# EAGLE design do31 (EAGLE 9.6.2)
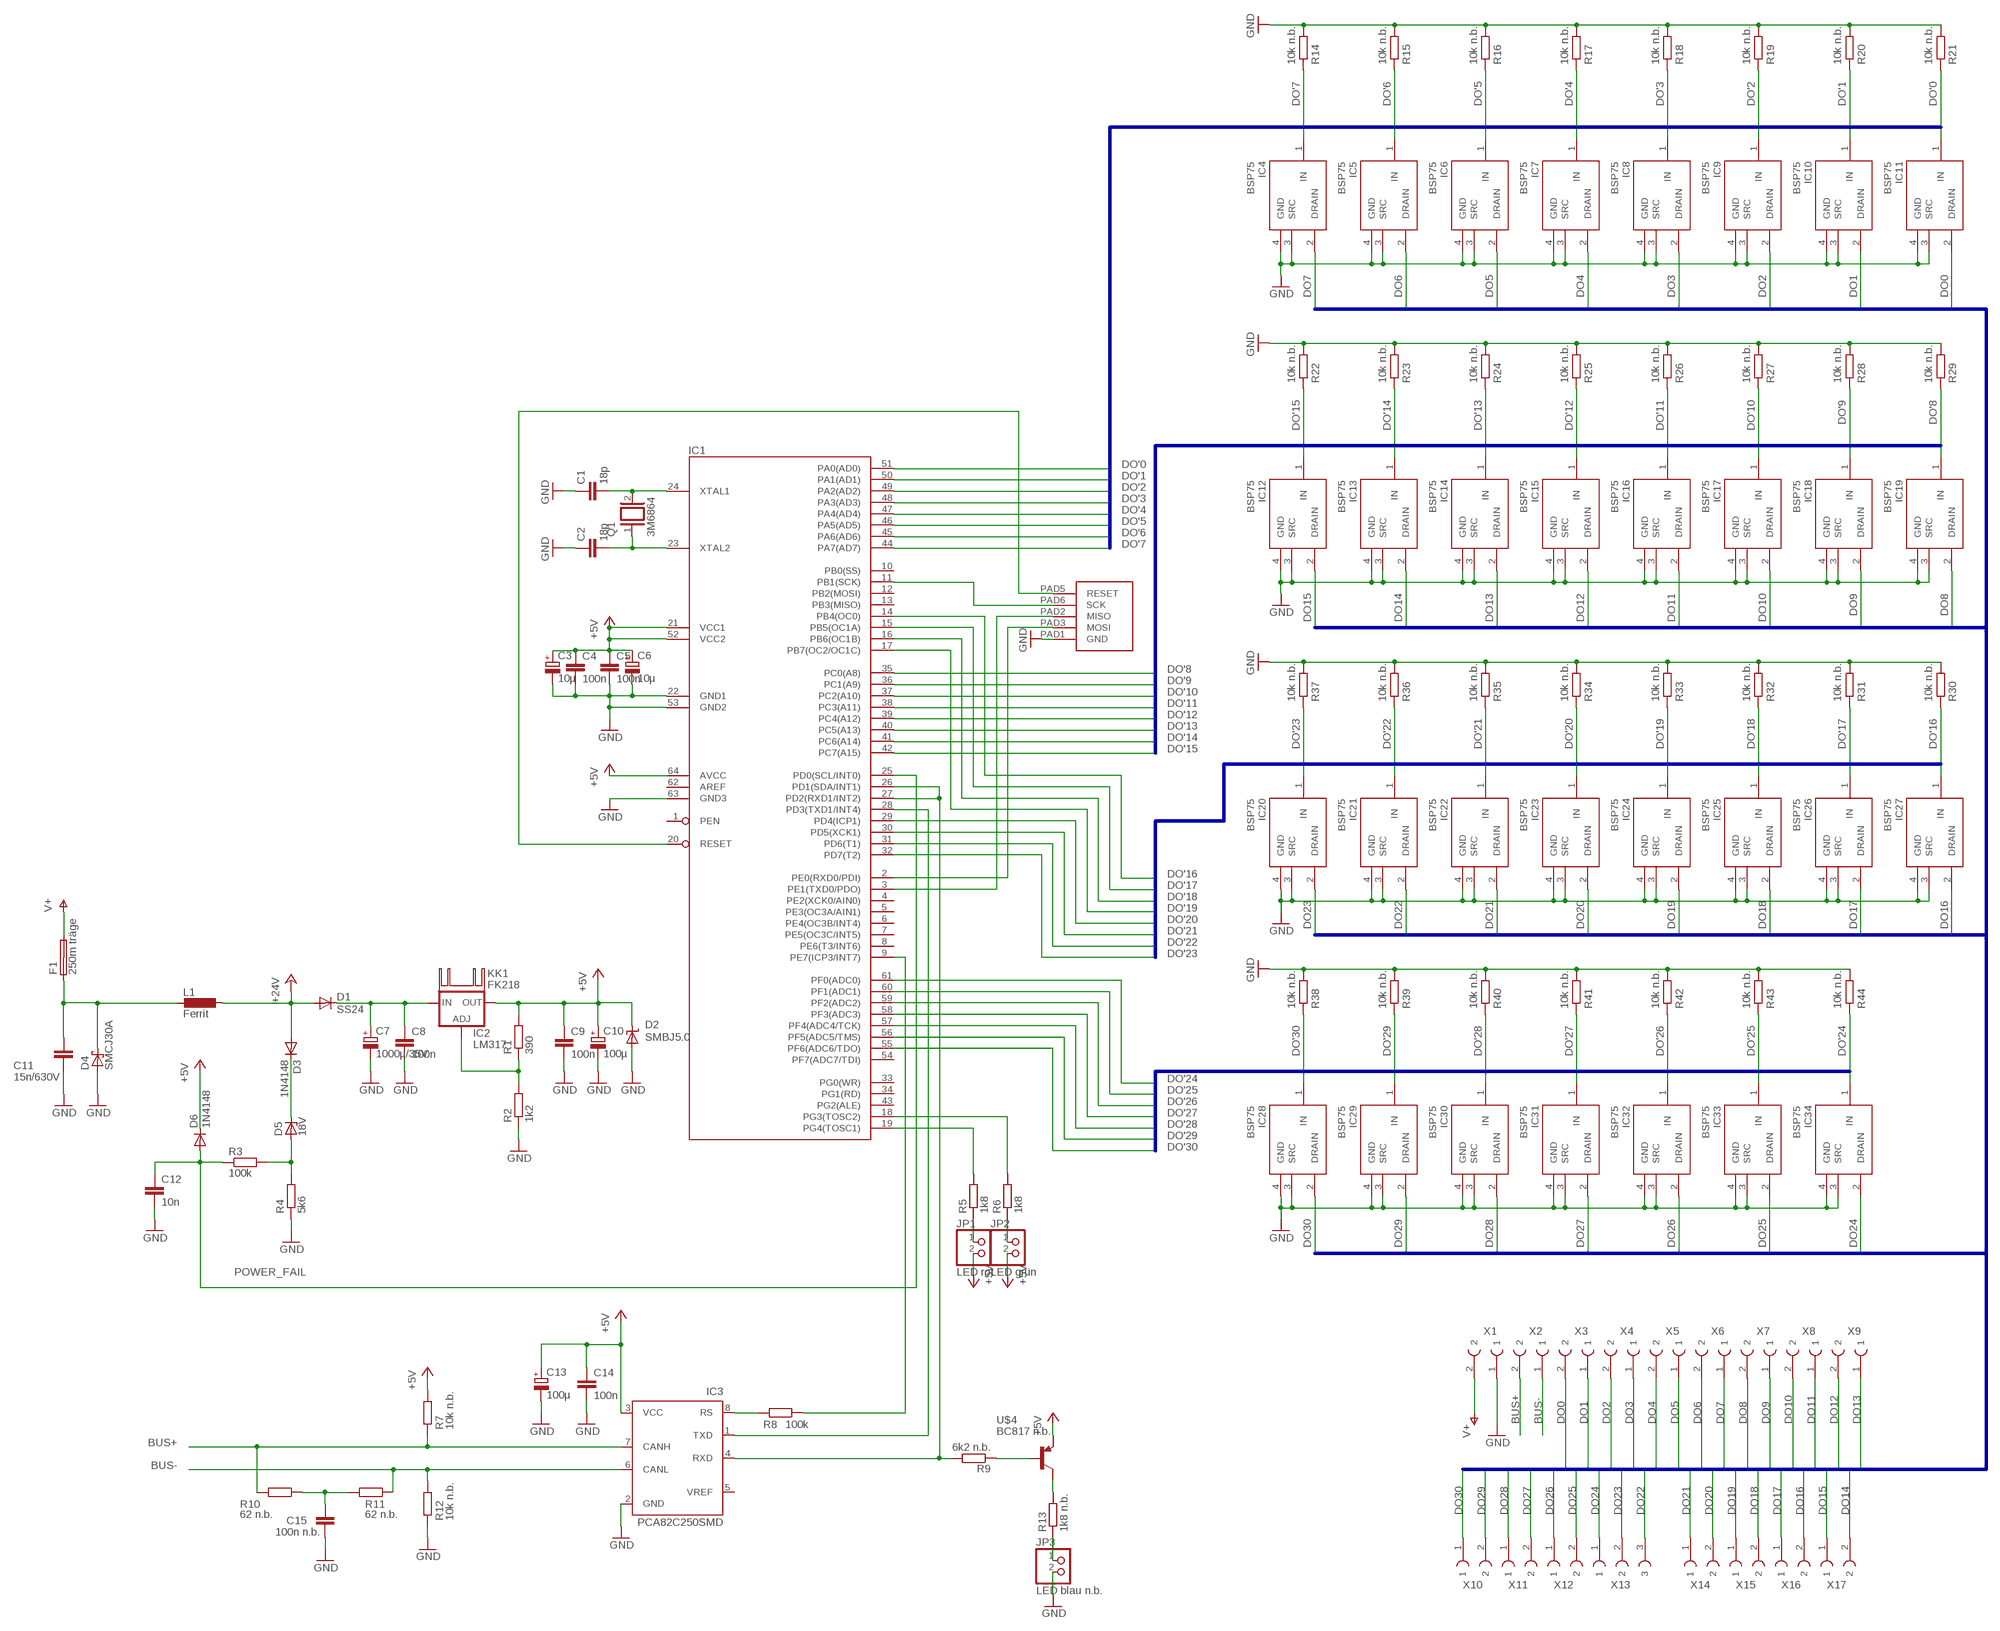
[diagram p0: schematic, sheet 1]

## Parts
C1  18p  C-EU025-024X044  [C025-024X044]
C2  18p  C-EU025-024X044  [C025-024X044]
C3  10µ  CPOL-EUE2-5  [E2-5]
C4  100n  C-EUC0603K  [C0603K]
C5  100n  C-EUC0603K  [C0603K]
C6  10µ  CPOL-EUE2-5  [E2-5]
C7  1000µ/35V  CPOL-EUE5-13  [E5-13]
C8  100n  C-EUC0603K  [C0603K]
C9  100n  C-EUC0603K  [C0603K]
C10  100µ  CPOL-EUE2.5-5  [E2,5-5]
C11  15n/630V  C-EU075-042X103  [C075-042X103]
C12  10n  C-EUC0603K  [C0603K]
C13  100µ  CPOL-EUE2.5-5  [E2,5-5]
C14  100n  C-EUC0603K  [C0603K]
C15  100n n.b.  C-EUC0603K  [C0603K]
D1  SS24  DIODE-SMB  [SMB]
D2  SMBJ5.0  SUPPRESSOR-SMBJ  [SMBJ]
D3  1N4148  DIODE-D-2.5  [D-2.5]
D4  SMCJ30A  SCHOTTKY-DIODESMC  [SMC]
D5  18V  ZENER-DIODEZD-2.5  [ZDIO-2.5]
D6  1N4148  DIODE-D-2.5  [D-2.5]
F1  250m träge  SHK20L  [SHK20L]
IC1  ATMEGA128  [TQFP64]
IC2  LM317  LM317TS  [317TS]
IC3  PCA82C250SMD  [SO8]
IC4  BSP75  [SOT223]
IC5  BSP75  [SOT223]
IC6  BSP75  [SOT223]
IC7  BSP75  [SOT223]
IC8  BSP75  [SOT223]
IC9  BSP75  [SOT223]
IC10  BSP75  [SOT223]
IC11  BSP75  [SOT223]
IC12  BSP75  [SOT223]
IC13  BSP75  [SOT223]
IC14  BSP75  [SOT223]
IC15  BSP75  [SOT223]
IC16  BSP75  [SOT223]
IC17  BSP75  [SOT223]
IC18  BSP75  [SOT223]
IC19  BSP75  [SOT223]
IC20  BSP75  [SOT223]
IC21  BSP75  [SOT223]
IC22  BSP75  [SOT223]
IC23  BSP75  [SOT223]
IC24  BSP75  [SOT223]
IC25  BSP75  [SOT223]
IC26  BSP75  [SOT223]
IC27  BSP75  [SOT223]
IC28  BSP75  [SOT223]
IC29  BSP75  [SOT223]
IC30  BSP75  [SOT223]
IC31  BSP75  [SOT223]
IC32  BSP75  [SOT223]
IC33  BSP75  [SOT223]
IC34  BSP75  [SOT223]
JP1  LED rot  PINHD-1X2  [1X02]
JP2  LED grün  PINHD-1X2  [1X02]
JP3  LED blau n.b.  PINHD-1X2  [1X02]
KK1  FK218  [FK218]
L1  Ferrit  L-EUL1806  [L1806]
Q1  3M6864  XTAL/S  [QS]
R1  390  R-EU_R0603  [R0603]
R2  1k2  R-EU_R0603  [R0603]
R3  100k  R-EU_R0603  [R0603]
R4  5k6  R-EU_R0603  [R0603]
R5  1k8  R-EU_R0603  [R0603]
R6  1k8  R-EU_R0603  [R0603]
R7  10k n.b.  R-EU_R0603  [R0603]
R8  100k  R-EU_R0603  [R0603]
R9  6k2 n.b.  R-EU_R0603  [R0603]
R10  62 n.b.  R-EU_R0603  [R0603]
R11  62 n.b.  R-EU_R0603  [R0603]
R12  10k n.b.  R-EU_R0603  [R0603]
R13  1k8 n.b.  R-EU_R0603  [R0603]
R14  10k n.b.  R-EU_R0603  [R0603]
R15  10k n.b.  R-EU_R0603  [R0603]
R16  10k n.b.  R-EU_R0603  [R0603]
R17  10k n.b.  R-EU_R0603  [R0603]
R18  10k n.b.  R-EU_R0603  [R0603]
R19  10k n.b.  R-EU_R0603  [R0603]
R20  10k n.b.  R-EU_R0603  [R0603]
R21  10k n.b.  R-EU_R0603  [R0603]
R22  10k n.b.  R-EU_R0603  [R0603]
R23  10k n.b.  R-EU_R0603  [R0603]
R24  10k n.b.  R-EU_R0603  [R0603]
R25  10k n.b.  R-EU_R0603  [R0603]
R26  10k n.b.  R-EU_R0603  [R0603]
R27  10k n.b.  R-EU_R0603  [R0603]
R28  10k n.b.  R-EU_R0603  [R0603]
R29  10k n.b.  R-EU_R0603  [R0603]
R30  10k n.b.  R-EU_R0603  [R0603]
R31  10k n.b.  R-EU_R0603  [R0603]
R32  10k n.b.  R-EU_R0603  [R0603]
R33  10k n.b.  R-EU_R0603  [R0603]
R34  10k n.b.  R-EU_R0603  [R0603]
R35  10k n.b.  R-EU_R0603  [R0603]
R36  10k n.b.  R-EU_R0603  [R0603]
R37  10k n.b.  R-EU_R0603  [R0603]
R38  10k n.b.  R-EU_R0603  [R0603]
R39  10k n.b.  R-EU_R0603  [R0603]
R40  10k n.b.  R-EU_R0603  [R0603]
R41  10k n.b.  R-EU_R0603  [R0603]
R42  10k n.b.  R-EU_R0603  [R0603]
R43  10k n.b.  R-EU_R0603  [R0603]
R44  10k n.b.  R-EU_R0603  [R0603]
U$1  ATMEL_ISP  [ATMEL_ISP]
U$4  BC817 n.b.  BC817  [SOT323-BEC]
X1  AR-KLEMME_508_2POLPTR  [W237-2E]
X2  AR-KLEMME_508_2POLPTR  [W237-2E]
X3  AR-KLEMME_508_2POLPTR  [W237-2E]
X4  AR-KLEMME_508_2POLPTR  [W237-2E]
X5  AR-KLEMME_508_2POLPTR  [W237-2E]
X6  AR-KLEMME_508_2POLPTR  [W237-2E]
X7  AR-KLEMME_508_2POLPTR  [W237-2E]
X8  AR-KLEMME_508_2POLPTR  [W237-2E]
X9  AR-KLEMME_508_2POLPTR  [W237-2E]
X10  AR-KLEMME_508_2POLPTR  [W237-2E]
X11  AR-KLEMME_508_2POLPTR  [W237-2E]
X12  AR-KLEMME_508_2POLPTR  [W237-2E]
X13  AR-KLEMME_508_3POLPTR  [W237-3E]
X14  AR-KLEMME_508_2POLPTR  [W237-2E]
X15  AR-KLEMME_508_2POLPTR  [W237-2E]
X16  AR-KLEMME_508_2POLPTR  [W237-2E]
X17  AR-KLEMME_508_2POLPTR  [W237-2E]

## Nets
+5V: C3.+ C4.1 C5.1 C6.+ C9.1 C10.+ C13.+ C14.1 D2.C D6.C IC1.21(VCC1) IC1.52(VCC2) IC1.64(AVCC) IC2.2(OUT) IC3.3(VCC) JP1.2 JP2.2 R1.2 R7.1 U$4.E
+24V: D1.A D3.A L1.1
/RESET: IC1.20(RESET) U$1.PAD5(RESET)
BUS+: IC3.7(CANH) R7.2 R10.2 X2.2
BUS-: IC3.6(CANL) R11.1 R12.1 X2.1
DO0: IC11.2(DRAIN) X3.2
DO1: IC10.2(DRAIN) X3.1
DO2: IC9.2(DRAIN) X4.2
DO3: IC8.2(DRAIN) X4.1
DO4: IC7.2(DRAIN) X5.2
DO5: IC6.2(DRAIN) X5.1
DO6: IC5.2(DRAIN) X6.2
DO7: IC4.2(DRAIN) X6.1
DO8: IC19.2(DRAIN) X7.2
DO9: IC18.2(DRAIN) X7.1
DO10: IC17.2(DRAIN) X8.2
DO11: IC16.2(DRAIN) X8.1
DO12: IC15.2(DRAIN) X9.2
DO13: IC14.2(DRAIN) X9.1
DO14: IC13.2(DRAIN) X17.2
DO15: IC12.2(DRAIN) X17.1
DO16: IC27.2(DRAIN) X16.2
DO17: IC26.2(DRAIN) X16.1
DO18: IC25.2(DRAIN) X15.2
DO19: IC24.2(DRAIN) X15.1
DO20: IC23.2(DRAIN) X14.2
DO21: IC22.2(DRAIN) X14.1
DO22: IC21.2(DRAIN) X13.3
DO23: IC20.2(DRAIN) X13.2
DO24: IC34.2(DRAIN) X13.1
DO25: IC33.2(DRAIN) X12.2
DO26: IC32.2(DRAIN) X12.1
DO27: IC31.2(DRAIN) X11.2
DO28: IC30.2(DRAIN) X11.1
DO29: IC29.2(DRAIN) X10.2
DO30: IC28.2(DRAIN) X10.1
DO'0: IC1.51(PA0(AD0)) IC11.1(IN) R21.2
DO'1: IC1.50(PA1(AD1)) IC10.1(IN) R20.2
DO'2: IC1.49(PA2(AD2)) IC9.1(IN) R19.2
DO'3: IC1.48(PA3(AD3)) IC8.1(IN) R18.2
DO'4: IC1.47(PA4(AD4)) IC7.1(IN) R17.2
DO'5: IC1.46(PA5(AD5)) IC6.1(IN) R16.2
DO'6: IC1.45(PA6(AD6)) IC5.1(IN) R15.2
DO'7: IC1.44(PA7(AD7)) IC4.1(IN) R14.2
DO'8: IC1.35(PC0(A8)) IC19.1(IN) R29.2
DO'9: IC1.36(PC1(A9)) IC18.1(IN) R28.2
DO'10: IC1.37(PC2(A10)) IC17.1(IN) R27.2
DO'11: IC1.38(PC3(A11)) IC16.1(IN) R26.2
DO'12: IC1.39(PC4(A12)) IC15.1(IN) R25.2
DO'13: IC1.40(PC5(A13)) IC14.1(IN) R24.2
DO'14: IC1.41(PC6(A14)) IC13.1(IN) R23.2
DO'15: IC1.42(PC7(A15)) IC12.1(IN) R22.2
DO'16: IC1.14(PB4(OC0)) IC27.1(IN) R30.2
DO'17: IC1.15(PB5(OC1A)) IC26.1(IN) R31.2
DO'18: IC1.16(PB6(OC1B)) IC25.1(IN) R32.2
DO'19: IC1.17(PB7(OC2/OC1C)) IC24.1(IN) R33.2
DO'20: IC1.29(PD4(ICP1)) IC23.1(IN) R34.2
DO'21: IC1.30(PD5(XCK1)) IC22.1(IN) R35.2
DO'22: IC1.31(PD6(T1)) IC21.1(IN) R36.2
DO'23: IC1.32(PD7(T2)) IC20.1(IN) R37.2
DO'24: IC1.61(PF0(ADC0)) IC34.1(IN) R44.2
DO'25: IC1.60(PF1(ADC1)) IC33.1(IN) R43.2
DO'26: IC1.59(PF2(ADC2)) IC32.1(IN) R42.2
DO'27: IC1.58(PF3(ADC3)) IC31.1(IN) R41.2
DO'28: IC1.57(PF4(ADC4/TCK)) IC30.1(IN) R40.2
DO'29: IC1.56(PF5(ADC5/TMS)) IC29.1(IN) R39.2
DO'30: IC1.55(PF6(ADC6/TDO)) IC28.1(IN) R38.2
GND: C1.1 C2.1 C3.- C4.2 C5.2 C6.- C7.- C8.2 C9.2 C10.- C11.2 C12.2 C13.- C14.2 C15.1 D2.A D4.A IC1.22(GND1) IC1.53(GND2) IC1.63(GND3) IC3.2(GND) IC4.3(SRC) IC4.4(GND) IC5.3(SRC) IC5.4(GND) IC6.3(SRC) IC6.4(GND) IC7.3(SRC) IC7.4(GND) IC8.3(SRC) IC8.4(GND) IC9.3(SRC) IC9.4(GND) IC10.3(SRC) IC10.4(GND) IC11.3(SRC) IC11.4(GND) IC12.3(SRC) IC12.4(GND) IC13.3(SRC) IC13.4(GND) IC14.3(SRC) IC14.4(GND) IC15.3(SRC) IC15.4(GND) IC16.3(SRC) IC16.4(GND) IC17.3(SRC) IC17.4(GND) IC18.3(SRC) IC18.4(GND) IC19.3(SRC) IC19.4(GND) IC20.3(SRC) IC20.4(GND) IC21.3(SRC) IC21.4(GND) IC22.3(SRC) IC22.4(GND) IC23.3(SRC) IC23.4(GND) IC24.3(SRC) IC24.4(GND) IC25.3(SRC) IC25.4(GND) IC26.3(SRC) IC26.4(GND) IC27.3(SRC) IC27.4(GND) IC28.3(SRC) IC28.4(GND) IC29.3(SRC) IC29.4(GND) IC30.3(SRC) IC30.4(GND) IC31.3(SRC) IC31.4(GND) IC32.3(SRC) IC32.4(GND) IC33.3(SRC) IC33.4(GND) IC34.3(SRC) IC34.4(GND) JP3.2 R2.1 R4.1 R12.2 R14.1 R15.1 R16.1 R17.1 R18.1 R19.1 R20.1 R21.1 R22.1 R23.1 R24.1 R25.1 R26.1 R27.1 R28.1 R29.1 R30.1 R31.1 R32.1 R33.1 R34.1 R35.1 R36.1 R37.1 R38.1 R39.1 R40.1 R41.1 R42.1 R43.1 R44.1 U$1.PAD1(GND) X1.1
MISO: IC1.3(PE1(TXD0/PDO)) U$1.PAD2(MISO)
MOSI: IC1.2(PE0(RXD0/PDI)) U$1.PAD3(MOSI)
N$1: C11.1 D4.C F1.1A L1.2
N$2: D3.C D5.C
N$3: D5.A R3.2 R4.2
N$4: C1.2 IC1.24(XTAL1) Q1.2
N$6: C2.2 IC1.23(XTAL2) Q1.1
N$7: IC3.8(RS) R8.2
N$8: IC1.9(PE7(ICP3/INT7)) R8.1
N$9: IC2.1(ADJ) R1.1 R2.2
N$13: R9.1 U$4.B
N$14: R13.2 U$4.C
N$16: C7.+ C8.1 D1.C IC2.3(IN)
N$24: JP3.1 R13.1
N$25: C15.2 R10.1 R11.2
N$113: JP1.1 R5.1
N$114: JP2.1 R6.1
N$115: IC1.19(PG4(TOSC1)) R5.2
N$116: IC1.18(PG3(TOSC2)) R6.2
POWER_FAIL: C12.1 D6.A IC1.25(PD0(SCL/INT0)) R3.1
RXD: IC1.26(PD1(SDA/INT1)) IC1.27(PD2(RXD1/INT2)) IC3.4(RXD) R9.2
SCK: IC1.11(PB1(SCK)) U$1.PAD6(SCK)
TXD: IC1.28(PD3(TXD1/INT4)) IC3.1(TXD)
V+: F1.2A X1.2
Unconnected: F1.1B F1.2B IC1.1(PEN) IC1.4(PE2(XCK0/AIN0)) IC1.5(PE3(OC3A/AIN1)) IC1.6(PE4(OC3B/INT4)) IC1.7(PE5(OC3C/INT5)) IC1.8(PE6(T3/INT6)) IC1.10(PB0(SS)) IC1.12(PB2(MOSI)) IC1.13(PB3(MISO)) IC1.33(PG0(WR)) IC1.34(PG1(RD)) IC1.43(PG2(ALE)) IC1.54(PF7(ADC7/TDI)) IC3.5(VREF)

## Buses
DO[0..30]
DO'[0..7]
DO'[8..15]
DO'[16..23]
DO'[23..30]

## Power pins joined to a net without a drawn wire
AREF: IC1.62(AREF)

## Library data of the parts
C1 C2 C4 C5 C8 C9 C11 C12 C14 C15 = rcl:C-EU: CAPACITOR, European symbol
C3 C6 C7 C10 C13 = rcl:CPOL-EU: POLARIZED CAPACITOR, European symbol
D1 D3 D6 = diode:DIODE-: DIODE
D2 = diode:SUPPRESSOR-: Suppressor diode
D4 = diode:SCHOTTKY-DIODE: Schottky Diode
D5 = diode:ZENER-DIODE: Z-Diode
F1 = fuse:SHK20L: FUSE HOLDER 5 x 20 mm, SH contact, SHH1 Schukat, E1073 Buerklin
IC1 = mylib:ATMEGA128
IC2 = v-reg:LM317TS: VOLTAGE REGULATOR
IC3 = mylib:PCA82C250: CAN CONTROLLER INTERFACE
IC4-IC34 = mylib:BSP75
JP1-JP3 = pinhead:PINHD-1X2: PIN HEADER
KK1 = heatsink:FK218: HEATSINK manufacturer Fischer/distributor Buerklin
L1 = mylib:L-EU: INDUCTOR, European symbol
Q1 = special:XTAL/S: CRYSTAL
R1-R44 = rcl:R-EU_: RESISTOR, European symbol
U$1 = mylib:ATMEL_ISP
U$4 = mylib:BC817
X1-X12 X14-X17 = mylib:AR-KLEMME_508_2POL
X13 = mylib:AR-KLEMME_508_3POL

## Board
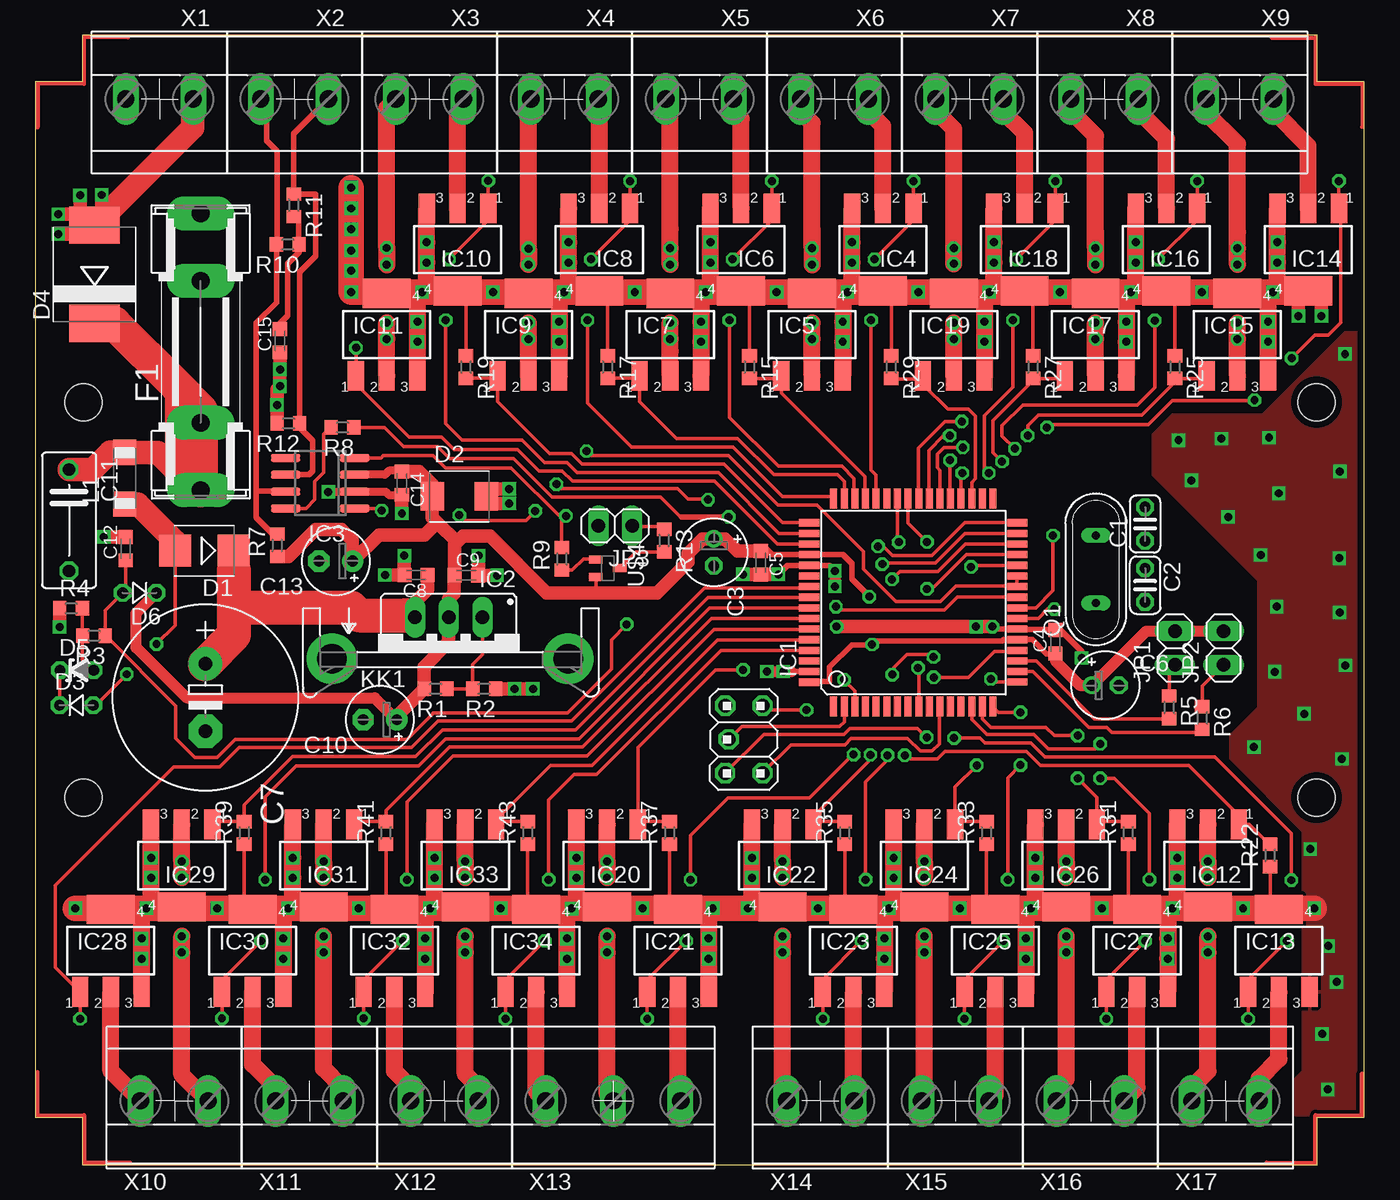
[diagram p1: board, top side]
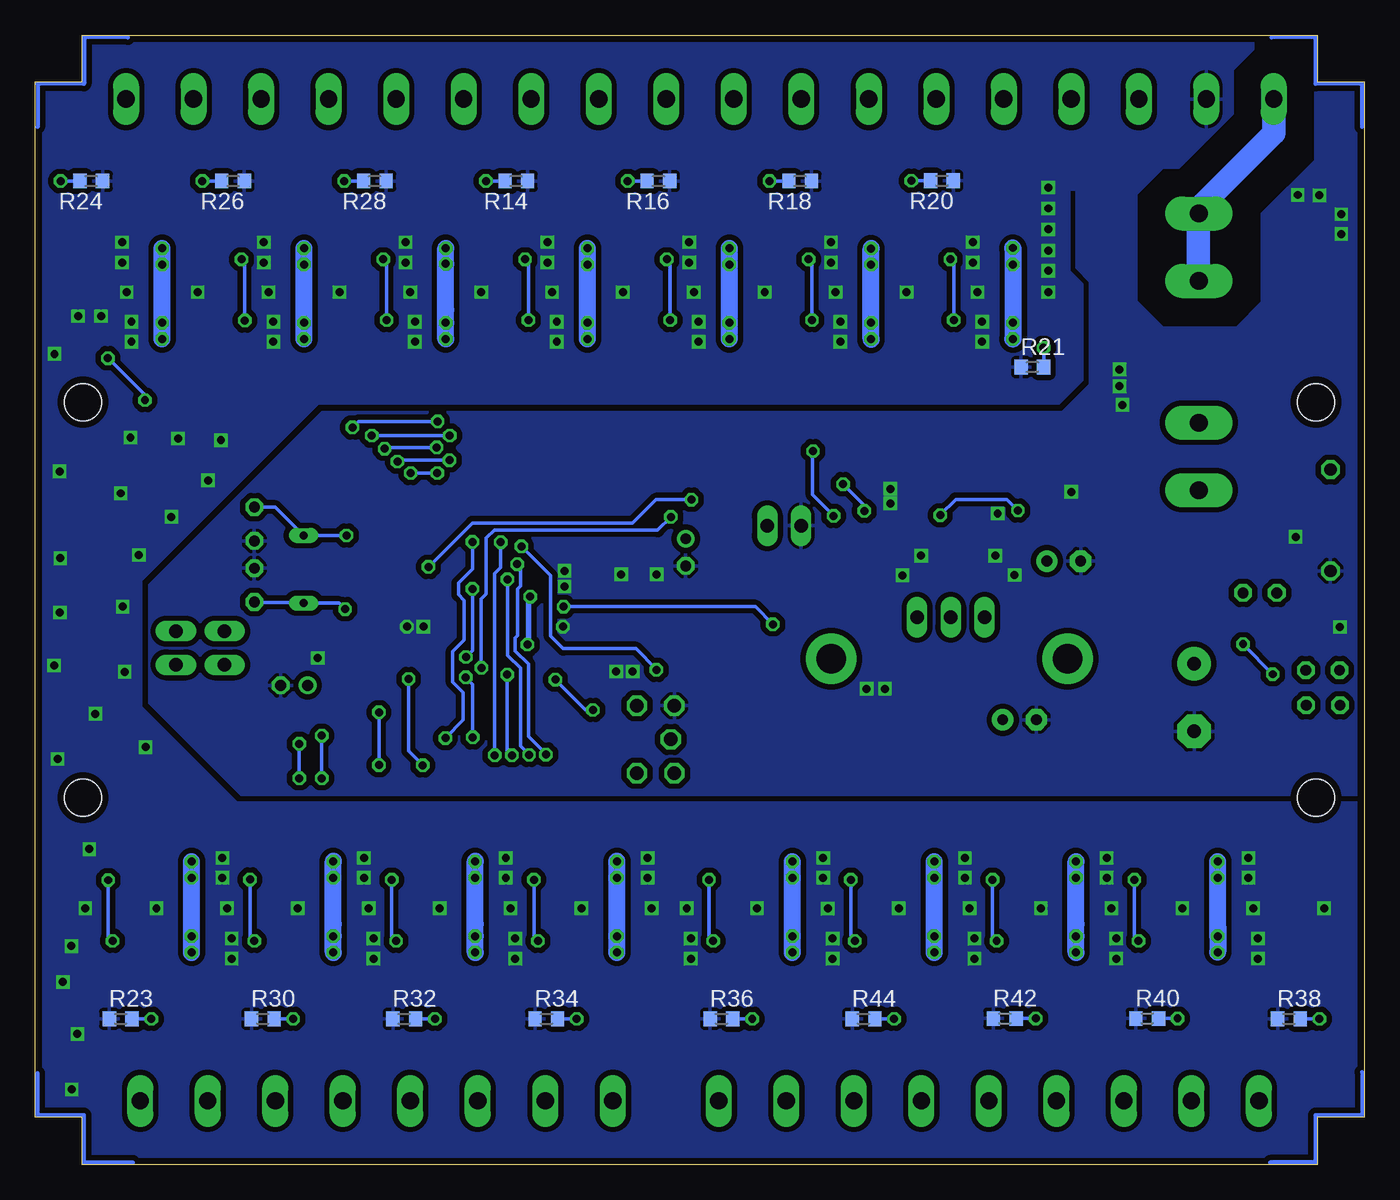
[diagram p2: board, bottom side, seen from below]

Size 100 x 84.99 mm. Coordinates in mm from the lower left corner, seen from the top.
Copper layers (1*16): Top 0.035mm / dielectric 1.5mm / Bottom 0.035mm
Design rules "Bilex DRU": minimum track width 10mil, minimum drill 24mil, track to track 10mil, track to pad 10mil, pad to pad 10mil, via to via 10mil, smd to smd 10mil, copper to edge 20mil, drill to drill 8mil, minimum pad ring 10mil, minimum via ring 8mil, stop-mask expansion 4mil, vias tented up to drill 24mil, thermal gap 10mil

### Footprints (pad centres in the part's own frame; a part is rotated, then mirrored left to right if it is on the bottom)
C025-024X044 = drill 0.813 octagon: 1 -1.27,0; 2 1.27,0
E2-5 = drill 0.813 pad 1.27: + -1.016,0 | drill 0.813 pad 1.27 octagon: - 1.016,0
C0603K = smd 1.05 x 1.08: 1 -0.875,0; 2 0.875,0
E5-13 = drill 1.016 pad 2.54: + -2.54,0 | drill 1.016 pad 2.54 octagon: - 2.54,0
E2,5-5 = drill 0.813 pad 1.6: + -1.27,0 | drill 0.813 pad 1.6 octagon: - 1.27,0
C075-042X103 = drill 0.914 octagon: 1 -3.81,0; 2 3.81,0
SMB = smd 2.4 x 2.4: A 2.2,0; C -2.2,0
SMBJ = smd 1.78 x 2.16: A 2.04,0; C -2.03,0
D-2.5 = drill 0.813 octagon: A 1.27,0; C -1.27,0
SMC = smd 2.8 x 3.8: A 3.7,0; C -3.7,0
ZDIO-2.5 = drill 0.813 octagon: A 1.27,0; C -1.27,0
SHK20L = drill 1.321 pad 2.54 long: 1A -10.414,0; 1B -5.334,0; 2A 10.414,0; 2B 5.334,0
TQFP64 = smd 1.524 x 0.533: 1 -7.942,6.125; 2 -7.942,5.318; 3 -7.942,4.521; 4 -7.942,3.723; 5 -7.942,2.926; 6 -7.942,2.119; 7 -7.942,1.321; 8 -7.942,0.524; 9 -7.942,-0.284; 10 -7.942,-1.081; 11 -7.942,-1.879; 12 -7.942,-2.676; 13 -7.942,-3.473; 14 -7.942,-4.281; 15 -7.942,-5.078; 16 -7.942,-5.875; 33 7.712,-5.875; 34 7.712,-5.078; 35 7.712,-4.281; 36 7.712,-3.473; 37 7.712,-2.676; 38 7.712,-1.879; 39 7.712,-1.081; 40 7.712,-0.284; 41 7.712,0.524; 42 7.712,1.321; 43 7.712,2.119; 44 7.712,2.926; 45 7.712,3.723; 46 7.712,4.521; 47 7.712,5.318; 48 7.712,6.125 | smd 0.533 x 1.524: 17 -6.106,-7.712; 18 -5.308,-7.712; 19 -4.511,-7.712; 20 -3.713,-7.712; 21 -2.916,-7.712; 22 -2.119,-7.712; 23 -1.311,-7.712; 24 -0.514,-7.712; 25 0.284,-7.712; 26 1.091,-7.712; 27 1.889,-7.712; 28 2.686,-7.712; 29 3.483,-7.712; 30 4.291,-7.712; 31 5.088,-7.712; 32 5.886,-7.712; 49 5.886,7.952; 50 5.088,7.952; 51 4.291,7.952; 52 3.483,7.952; 53 2.686,7.952; 54 1.889,7.952; 55 1.081,7.952; 56 0.284,7.952; 57 -0.514,7.952; 58 -1.311,7.952; 59 -2.108,7.952; 60 -2.916,7.952; 61 -3.713,7.952; 62 -4.511,7.952; 63 -5.318,7.952; 64 -6.11,7.952
317TS = drill 1.016 long: 1 -2.54,-2.54; 2 0,-2.54; 3 2.54,-2.54
SO8 = smd 0.6 x 2.2: 1 -1.905,-2.6; 2 -0.635,-2.6; 3 0.635,-2.6; 4 1.905,-2.6; 5 1.905,2.6; 6 0.635,2.6; 7 -0.635,2.6; 8 -1.905,2.6
SOT223 = smd 1.219 x 2.235: 1 -2.311,-3.099; 2 0,-3.099; 3 2.311,-3.099 | smd 3.6 x 2.2: 4 0,3.099
1X02 = drill 1.016 long: 1 -1.27,0; 2 1.27,0
FK218 = drill 2.21 pad 3.81: A2,2 -8.89,-0.508; B2,2 8.89,-0.508
L1806 = smd 1.9 x 1.7: 1 -0.68,0; 2 3.22,0
QS = drill 0.61 long: 1 -2.54,0; 2 2.54,0
R0603 = smd 1 x 1.1: 1 -0.85,0; 2 0.85,0
ATMEL_ISP = drill 1.016 octagon: PAD1 1.397,-2.54; PAD2 -1.41,-2.54; PAD3 1.13,0; PAD5 1.41,2.54; PAD6 -1.41,2.54
GEHÄUSE_MR6 = hole 2.8: 3.632,57.379; 3.632,27.61; 96.418,27.61; 96.418,57.379
SOT323-BEC = smd 0.6 x 1: B -0.65,-0.9; C 0,0.9; E 0.65,-0.9
W237-2E = drill 1.3 long: 1 -2.54,0; 2 2.54,0
W237-3E = drill 1.3 long: 1 -5.08,0; 2 0,0; 3 5.08,0

### Placement (x,y rotation side)
C1  83.52,48.21 90 top
C2  83.52,43.61 270 top
C3  51.05,46.08 270 top
C4  76.76,39.34 90 top
C5  54.58,45.29 270 top
C6  80.52,36.07 0 top
C7  12.8,35.15 270 top
C8  28.65,44.37 180 top
C9  32.44,44.35 0 top
C10  25.93,33.48 180 top
C11  2.54,48.49 270 top
C12  6.81,46.36 90 top
C13  22.61,45.42 180 top
C14  27.58,51.28 270 top
C15  18.41,62 90 top
D1  12.73,46.2 180 top
D2  31.9,50.29 0 top
D3  3.1,34.57 0 top
D4  4.47,67.01 90 top
D5  3.12,37.21 0 top
D6  7.85,43.03 180 top
F1  12.45,61.16 90 top
IC1  66.19,42.42 90 top
IC2  31.11,38.66 180 top
IC3  21.44,51.28 90 top
IC4  63.78,68.86 180 top
IC5  58.45,62.46 0 top
IC6  53.11,68.86 180 top
IC7  47.78,62.46 0 top
IC8  42.44,68.86 180 top
IC9  37.11,62.46 0 top
IC10  31.78,68.86 180 top
IC11  26.44,62.46 0 top
IC12  88.24,22.5 180 top
IC13  93.57,16.1 0 top
IC14  95.78,68.86 180 top
IC15  90.45,62.46 0 top
IC16  85.12,68.86 180 top
IC17  79.78,62.46 0 top
IC18  74.45,68.86 180 top
IC19  69.11,62.46 0 top
IC20  43.03,22.5 180 top
IC21  48.36,16.1 0 top
IC22  56.24,22.5 180 top
IC23  61.57,16.1 0 top
IC24  66.9,22.5 180 top
IC25  72.24,16.1 0 top
IC26  77.57,22.5 180 top
IC27  82.91,16.1 0 top
IC28  5.69,16.1 0 top
IC29  11.02,22.5 180 top
IC30  16.36,16.1 0 top
IC31  21.69,22.5 180 top
IC32  27.03,16.1 0 top
IC33  32.36,22.5 180 top
IC34  37.69,16.1 0 top
JP1  85.75,38.89 90 top
JP2  89.41,38.89 90 top
JP3  43.64,48.08 180 top
KK1  31.22,38.58 0 top
L1  6.73,50.39 90 top
Q1  79.81,44.81 90 top
R1  30.12,35.81 180 top
R2  33.78,35.81 180 top
R3  4.42,39.8 180 top
R4  2.69,41.86 0 top
R5  85.32,34.42 270 top
R6  87.81,33.6 270 top
R7  18.21,46.61 90 top
R8  23.11,55.47 180 top
R9  39.62,45.59 90 top
R10  19,69.24 180 top
R11  19.46,72.19 270 top
R12  19.05,55.78 180 top
R13  47.32,46.96 270 top
R14  63.8,74.02 180 bottom
R15  53.75,60.02 270 top
R16  53.11,74.02 180 bottom
R17  43.08,60.02 270 top
R18  42.44,74.02 180 bottom
R19  32.41,60.02 270 top
R20  31.78,74.04 180 bottom
R21  24.97,60.02 0 bottom
R22  92.91,23.27 90 top
R23  93.57,10.97 0 bottom
R24  95.78,74.02 180 bottom
R25  85.75,60.02 270 top
R26  85.12,74.02 180 bottom
R27  75.08,60.02 270 top
R28  74.45,74.02 180 bottom
R29  64.41,60.02 270 top
R30  82.88,10.97 0 bottom
R31  82.25,24.97 90 top
R32  72.24,10.97 0 bottom
R33  71.58,24.97 90 top
R34  61.54,10.97 0 bottom
R35  60.91,24.97 90 top
R36  48.36,10.97 0 bottom
R37  47.73,24.97 90 top
R38  5.66,10.97 0 bottom
R39  15.72,24.97 90 top
R40  16.33,11 0 bottom
R41  26.39,24.97 90 top
R42  27.05,11 0 bottom
R43  37.06,24.97 90 top
R44  37.67,10.97 0 bottom
U$1  53.31,32 180 top
U$3  [GEHÄUSE_MR6]  0,0 0 top
U$4  43.08,44.88 270 top
X1  9.35,80.19 180 top
X2  19.51,80.19 180 top
X3  29.67,80.19 180 top
X4  39.83,80.19 180 top
X5  49.99,80.19 180 top
X6  60.15,80.19 180 top
X7  70.31,80.19 180 top
X8  80.47,80.19 180 top
X9  90.63,80.19 180 top
X10  10.46,4.8 0 top
X11  20.62,4.8 0 top
X12  30.78,4.8 0 top
X13  43.48,4.8 0 top
X14  59.08,4.8 0 top
X15  69.24,4.8 0 top
X16  79.4,4.8 0 top
X17  89.56,4.8 0 top

### Tracks (layer width: path | path; a pad name or v marks a point on that pad's centre or on a via)
+5V  (via drill 0.6)
  Top 0.254: 42.16,43.03 42.16,43.1 42.18,43.12 U$4.E | C14.1 27.58,52.22
  Top 0.305: IC1.52 | IC1.64 58.31,36.31 58.34,36.27 58.45,36.37
  Top 0.406: C5.1 54.75,46.16 54.97,46.38 55.44,45.9 IC1.52 60.78,45.9 61.44,45.24 61.44,44.07 v62.76,42.75 | 58.45,36.37 59.77,36.37 59.77,37.44 61.44,39.12 61.47,39.12 | 61.47,39.12 61.44,39.09 | 61.47,39.12 62.99,39.12 v62.97,39.14 62.97,39.12 63.25,39.4 72.77,39.4 72.88,39.5 IC1.21 75.03,39.5 76.1,38.43 76.78,38.43 76.78,38.44 C4.1
  Top 0.61: IC3.3 26.31,51.92 26.62,52.22 27.58,52.22
  Top 0.813: D6.C 7.59,41.5 7.59,38.91 11.38,35.13 25.55,35.13 C10.+ | C4.1 76.76,37.9 78.59,36.07 C6.+ | C6.+ 79.53,36.07 | JP1.2 85.8,40.16 | C6.+ 83.59,40.16 JP1.2 | JP1.2 JP2.2
  Top 1.016: 31.75,46.84 31.56,46.65 C9.1 31.52,44.35 31.52,42.98 31.11,42.57 IC2.2 31.11,39.32 29.26,37.46 29.26,35.81 R1.2 29.27,35.8 27.2,33.73 C10.+ | 31.75,46.84 30.25,48.34 | 30.25,48.34 29.31,47.4 25.86,47.4 C13.+ 23.85,45.44 23.82,45.44 23.82,47.02 23.04,47.8 21.11,47.8 19.06,45.76 R7.1 | 51.08,47.09 C3.+ 51.08,47.07 | 51.08,47.07 50.19,47.07 49.1,45.97 49.1,45.34 46.79,43.03 42.16,43.03 38.48,43.03 34.21,47.29 32.21,47.29 31.75,46.84 | C5.1 52.82,46.16 51.92,47.07 51.08,47.07 | C14.1 28.89,52.16 29.84,51.21 29.84,50.32 D2.C 29.87,48.69 30.23,48.34 30.25,48.34
  Bottom 0.406: v62.76,42.75 62.86,42.65 62.86,39.29 62.99,39.17 v62.97,39.14
+24V  (via drill 0.6)
  Top 0.254: D3.A 4.55,34.57 v6.88,36.91 | D1.A 10.52,46.19 10.52,40.56 v9.12,39.17
  Top 1.778: L1.1 7.72,49.71 10.49,46.94 10.49,46.2 D1.A
  Bottom 0.254: v6.88,36.91 9.12,39.14 v9.12,39.17
/RESET  (via drill 0.6)
  Top 0.254: 73.88,38.68 73.81,38.61 72.16,38.61 70.23,36.68 v67.61,36.68 | v67.08,32.16 66.4,32.84 61.29,32.84 60.83,32.38 54.84,32.38 U$1.PAD5
  Top 0.305: 73.88,38.68 IC1.20
  Bottom 0.254: v67.61,36.68 67.08,36.14 v67.08,32.16
BUS+
  Top 0.406: IC3.7 18.74,50.75 | IC3.7 18.84,50.62 | R7.2 17.84,47.46 16.61,48.69 16.61,50.65 | IC3.7 18.84,50.67 16.61,50.67 16.61,50.65 | X2.2 17.42,79.73 17.42,77.04 18.19,76.28 18.19,69.21 18.17,69.21 R10.2 18.15,64.88 16.64,63.37 16.64,50.65 16.61,50.65
BUS-
  Top 0.406: X2.1 19.46,77.6 R11.1 21.11,73.04 21.11,68.38 19.89,67.16 19.89,55.85 19.96,55.78 R12.1 19.9,55.46 20.88,54.48 20.88,52.2 20.6,51.92 IC3.6
DO0  (via drill 0.6)
  Top 1.27: IC11.2 v26.44,62.13 v26.44,63.35 | 26.44,67.72 v26.44,67.74 26.44,68.58 v26.44,68.99 26.44,79.5 X3.2
  Bottom 1.27: v26.44,62.13 26.42,62.13 26.42,68.91 26.44,68.94 v26.44,68.99
DO1
  Top 1.27: IC10.2 31.78,78.82 32.21,79.25 X3.1
DO2  (via drill 0.6)
  Top 1.27: IC9.2 v37.11,62.13 v37.11,63.35 | v37.11,67.74 v37.11,68.94 37.11,80.01 X4.2
  Bottom 1.27: 37.11,62.1 v37.11,62.13 v37.11,68.94
DO3
  Top 1.27: IC8.2 42.44,80.11 X4.1
DO4  (via drill 0.6)
  Top 1.27: IC7.2 47.78,61.21 | 47.78,61.21 v47.78,62.13 | X5.2 47.45,80.21 47.78,79.88 47.78,70.41 | v47.78,68.96 47.78,70.41 | v47.78,67.74 47.78,70.41 | 47.78,61.21 v47.78,63.35
  Bottom 1.27: v47.78,68.96 v47.78,67.74 v47.78,63.35 v47.78,62.13
DO5
  Top 1.27: IC6.2 53.11,78.69 52.53,79.27 X5.1 52.53,80.21
DO6  (via drill 0.6)
  Top 1.27: IC5.2 v58.45,62.13 v58.45,63.35 | v58.45,68.96 58.45,70.38 | 58.45,70.38 58.45,67.72 | 58.45,70.38 58.45,78.38 57.63,79.2 57.63,80.16 X6.2
  Bottom 1.27: v58.45,63.35 58.45,64.41 | 58.45,64.41 v58.45,67.74 v58.45,68.96 | v58.45,62.13 58.45,64.41
DO7
  Top 1.27: IC4.2 63.78,78.16 62.69,79.25 X6.1
DO8  (via drill 0.6)
  Top 1.27: IC19.2 v69.11,62.13 v69.11,63.35 | v69.11,68.96 69.11,70.13 | 69.11,70.13 69.11,77.93 67.77,79.27 X7.2 67.77,80.21 | v69.11,67.79 69.11,70.13
  Bottom 1.27: v69.11,63.35 69.11,64.34 | 69.11,64.34 v69.11,67.79 v69.11,68.96 | v69.11,62.13 69.11,64.34
DO9
  Top 1.27: IC18.2 74.45,77.62 72.82,79.25 72.82,80.21 X7.1
DO10  (via drill 0.6)
  Top 1.27: IC17.2 v79.78,62.13 v79.78,63.35 | v79.78,68.96 79.78,70.18 | 79.78,70.18 79.78,77.42 77.9,79.3 77.9,80.19 X8.2 | 79.78,70.18 79.78,67.72
  Bottom 1.27: v79.78,63.35 79.78,64.24 | 79.78,64.24 v79.78,67.74 v79.78,68.96 | v79.78,62.13 79.78,64.24
DO11
  Top 1.27: IC16.2 85.12,77.19 83.01,79.3 X8.1
DO12  (via drill 0.6)
  Top 1.27: IC15.2 v90.45,62.13 v90.45,63.35 | v90.45,68.96 90.45,70.18 | 90.45,70.18 90.45,76.81 88.09,79.17 X9.2 | v90.45,67.74 90.45,70.18
  Bottom 1.27: v90.45,63.35 90.45,64.29 | 90.45,64.29 v90.45,67.74 v90.45,68.96 | v90.45,62.13 90.45,64.29
DO13
  Top 1.27: IC14.2 95.78,76.66 93.14,79.3 93.14,80.19 X9.1
DO14
  Top 1.27: IC13.2 93.57,7.95 92.1,6.48 X17.2 92.1,4.77
DO15  (via drill 0.6)
  Top 1.27: v88.24,21.59 v88.24,22.81 IC12.2 | X17.1 87.02,5.82 88.24,7.04 v88.24,15.98 v88.24,17.2
  Bottom 1.27: v88.24,17.2 88.24,18.19 | 88.24,18.19 v88.24,22.81 | v88.24,15.98 88.24,18.19
DO16
  Top 1.27: X16.2 81.91,4.8 82.91,5.79 IC27.2
DO17  (via drill 0.6)
  Top 1.27: v77.57,21.59 v77.57,22.81 IC26.2 | X16.1 76.86,5.74 77.57,6.45 v77.57,15.98 v77.57,17.2
  Bottom 1.27: 77.57,22.83 v77.57,22.81 77.57,18.11 | v77.57,17.2 77.57,18.11 | v77.57,15.98 77.57,18.11
DO18
  Top 1.27: X15.2 71.78,4.77 72.24,5.23 IC25.2
DO19  (via drill 0.6)
  Top 1.27: v66.9,21.59 v66.9,22.81 IC24.2 | X15.1 66.9,5 v66.9,15.98 v66.9,17.2
  Bottom 1.27: 66.9,22.83 v66.9,22.81 66.9,18.11 | v66.9,17.2 66.9,18.11 | v66.9,15.98 66.9,18.11
DO20
  Top 1.27: IC23.2 61.57,4.85 X14.2
DO21  (via drill 0.6)
  Top 1.27: v56.24,21.59 v56.24,22.81 IC22.2 | X14.1 56.24,5.11 v56.24,15.98 v56.24,17.2
  Bottom 1.27: 56.24,22.83 v56.24,22.81 56.24,18.14 | v56.24,17.2 56.24,18.14 | v56.24,15.98 56.24,18.14
DO22
  Top 1.27: IC21.2 48.36,5 X13.3
DO23  (via drill 0.6)
  Top 1.27: v43.03,21.59 v43.03,22.81 IC20.2 | X13.2 43.48,4.83 43.03,5.28 v43.03,15.98 v43.03,17.2
  Bottom 1.27: v43.03,17.2 43.03,18.03 | 43.03,18.03 v43.03,22.81 | v43.03,15.98 43.03,18.03
DO24
  Top 1.27: X13.1 38.43,4.8 37.69,5.54 IC34.2
DO25  (via drill 0.6)
  Top 1.27: v32.36,21.59 v32.36,22.81 IC33.2 | X12.2 33.32,5.87 32.36,6.83 v32.36,15.98 v32.36,17.2
  Bottom 1.27: v32.36,17.2 32.36,18.06 | 32.36,18.06 v32.36,22.81 | v32.36,15.98 32.36,18.06
DO26
  Top 1.27: X12.1 28.24,5.82 27.03,7.04 IC32.2
DO27  (via drill 0.6)
  Top 1.27: v21.69,21.59 v21.69,22.81 IC31.2 | X11.2 23.16,5.77 21.69,7.24 v21.69,15.98 v21.69,17.2
  Bottom 1.27: v21.69,17.2 21.69,18.11 | 21.69,18.11 v21.69,22.81 | v21.69,15.98 21.69,18.11
DO28
  Top 1.27: X11.1 18.08,5.82 16.36,7.54 IC30.2
DO29  (via drill 0.6)
  Top 1.27: v11.02,21.59 v11.02,22.81 IC29.2 | X10.2 11.02,6.78 v11.02,15.98 v11.02,17.2
  Bottom 1.27: v11.02,17.2 11.02,17.93 | 11.02,17.93 v11.02,22.81 | 11.02,17.93 11.02,16
DO30
  Top 1.27: X10.1 7.95,4.8 5.69,7.06 IC28.2
DO'0  (via drill 0.6)
  Top 0.254: IC1.51 55.83,46.71 51.1,51.43 40.41,51.43 39.65,52.2 37.9,52.2 36.3,53.8 31.52,53.8 30.58,54.74 28.14,54.74 24.13,58.75 IC11.1 v24.13,61.47
  Bottom 0.254: R21.2 v24.12,61.46 v24.13,61.47
DO'1  (via drill 0.6)
  Top 0.254: IC1.50 55.97,47.51 51.41,52.07 40.77,52.07 40,52.83 38.33,52.83 36.63,54.53 32.11,54.53 30.89,55.75 v30.89,63.55 | v31.14,68.12 34.09,71.07 IC10.1 v34.09,74.04
  Bottom 0.254: v30.89,63.55 30.89,67.87 v31.14,68.12 | v34.09,74.04 R20.2
DO'2
  Top 0.254: IC1.49 56.22,48.3 51.82,52.7 41.15,52.7 40.36,53.49 38.71,53.49 34.8,57.4 34.8,57.53 | 34.8,57.53 IC9.1 34.62,59.18 R19.2 | 34.8,57.53 34.8,57.51
DO'3  (via drill 0.6)
  Top 0.254: 59.97,50.11 59.82,50.27 56.24,50.27 52.5,54 44.86,54 41.55,57.3 v41.55,63.55 | v41.81,68.12 44.75,71.07 IC8.1 v44.75,74.02
  Top 0.305: 59.97,50.11 59.99,50.13 IC1.48
  Bottom 0.254: v41.81,68.12 41.55,67.87 v41.55,63.55 | v44.75,74.02 R18.2
DO'4
  Top 0.254: IC1.47 60.87,51.42 60.38,51.92 55.57,51.92 52.86,54.64 48.26,54.64 45.47,57.43 IC7.1 | IC7.1 45.47,59.38 | R17.2 45.29,59.18 IC7.1
DO'5  (via drill 0.6)
  Top 0.254: 61.62,50.18 61.62,51.64 60.71,52.55 55.91,52.55 52.22,56.24 v52.22,63.55 | v52.48,68.12 55.42,71.07 IC6.1 v55.42,74.02
  Top 0.305: 61.62,50.18 IC1.46
  Bottom 0.254: v52.48,68.12 52.22,67.87 v52.22,63.55 | v55.42,74.02 R16.2
DO'6
  Top 0.254: 62.43,50.17 62.43,51.76 56.13,58.06 IC5.1 55.93,59.16 53.75,59.16 R15.2
  Top 0.305: 62.43,50.17 IC1.45
DO'7  (via drill 0.6)
  Top 0.254: v63.14,68.12 66.09,71.07 IC4.1 v66.09,74.02 | v62.89,63.55 62.89,52.27 63.27,51.89 IC1.44
  Top 0.305: IC1.44 63.27,50.22
  Bottom 0.254: v63.14,68.12 63.12,68.12 62.89,67.89 v62.89,63.55 | v66.09,74.02 R14.2
DO'8
  Top 0.254: IC1.35 70.46,51.33 70.74,51.61 70.74,56.34 70.23,56.84 68.66,56.84 66.83,58.67 66.83,59.33 IC19.1 66.55,59.11 64.41,59.11 R29.2
  Top 0.305: IC1.35
DO'9  (via drill 0.6)
  Top 0.254: v69.75,52.04 69.75,52.07 69.67,52.07 69.67,50.27 | v71.75,52.04 71.4,52.4 71.4,56.36 73.56,58.52 v73.56,63.55 | v73.81,68.12 76.76,71.07 IC18.1 v76.76,74.02
  Top 0.305: IC1.36 69.67,50.27
  Bottom 0.254: 71.78,52.04 v71.75,52.04 v69.75,52.04 | v73.81,68.12 73.56,67.87 v73.56,63.55 | v76.76,74.02 R28.2
DO'10  (via drill 0.6)
  Top 0.254: IC1.37 68.83,50.16 68.83,53.03 | 68.83,53.03 v68.83,53.01 | 68.83,53.03 68.81,53.03 | v72.75,52.91 72.06,53.59 72.06,55.98 75.08,59 75.08,59.16 | 75.08,59.16 R27.2 | IC17.1 77.27,59.16 75.08,59.16
  Top 0.305: IC1.37 68.88,50.15
  Bottom 0.254: 72.8,52.91 72.82,52.88 | 72.8,52.91 v72.75,52.91 | v68.83,53.01 72.69,53.01 72.8,52.91
DO'11  (via drill 0.6)
  Top 0.254: 68.07,50.34 68.07,52.25 67.87,52.45 67.87,53.47 68.38,53.97 v69.8,53.97 69.82,53.97 | v73.71,53.87 72.75,54.84 72.75,55.6 74.32,57.18 82.93,57.18 84.23,58.47 v84.23,63.53 | v84.48,68.12 87.43,71.07 87.43,71.93 | 87.43,71.93 IC16.1 | 87.43,71.93 v87.43,74.02
  Top 0.305: 68.07,50.34 IC1.38
  Bottom 0.254: v73.71,53.87 73.76,53.87 73.79,53.9 73.71,53.97 v69.8,53.97 | v84.48,68.12 84.23,67.87 v84.23,63.53 | v87.43,74.02 R26.2
DO'12  (via drill 0.6)
  Top 0.254: 67.23,50.17 67.23,53.75 68.35,54.86 v68.81,54.86 | v74.68,54.86 74.68,55.6 75.49,56.41 83.26,56.41 85.75,58.9 85.75,59.16 | 85.75,59.16 R25.2 | IC15.1 87.93,59.16 85.75,59.16
  Top 0.305: IC1.39 67.23,50.17
  Bottom 0.254: v68.81,54.86 v74.68,54.86
DO'13  (via drill 0.6)
  Top 0.254: IC1.40 66.47,53.92 68.45,55.91 69.7,55.91 v69.72,55.93 | v76.12,55.47 76.35,55.7 83.74,55.7 85.55,57.51 91.74,57.51 v91.74,57.53 | v94.54,60.68 96.29,62.43 97.31,62.43 98.25,63.37 98.25,72.03 98.09,72.19 IC14.1 v98.09,74.02
  Top 0.305: IC1.40
  Bottom 0.254: v69.72,55.93 75.67,55.93 v76.12,55.47 | v94.54,60.68 94.51,60.68 91.74,57.91 v91.74,57.53 | v98.09,74.02 R24.2
DO'14  (via drill 0.6)
  Top 0.254: IC1.41 65.67,48.3 v67.11,46.86 | v69.14,32.11 71.09,32.11 71.45,31.75 74.9,31.75 75.97,30.68 88.75,30.68 94.51,24.92 v94.51,21.41 | v91.26,10.97 IC13.1 91.26,13.94 94.16,16.84 v94.18,16.84
  Bottom 0.254: v67.11,46.86 67.11,44.81 68.15,43.76 68.15,42.9 67.72,42.47 67.72,39.5 68.58,38.63 68.58,36.32 67.79,35.53 67.79,33.45 v69.14,32.11 | v91.26,10.97 R23.2 | v94.51,21.41 94.51,17.17 v94.18,16.84
DO'15  (via drill 0.6)
  Top 0.254: v64.97,46.84 65,46.84 64.87,46.96 IC1.42 | v65.43,30.81 65.71,30.53 67.89,30.53 68.45,31.09 74.57,31.09 75.62,30.05 86.79,30.05 90.53,26.31 90.53,25.58 IC12.1 91.36,25.6 92.89,24.08 R22.2
  Bottom 0.254: v64.97,46.84 64.97,44.93 65.43,44.48 v65.43,30.81 65.4,30.78
DO'16  (via drill 0.6)
  Top 0.254: IC1.14 70.47,33.51 71.6,32.38 75.16,32.38 76.25,31.29 79.76,31.29 v80.14,31.67 | v80.59,10.97 IC27.1 80.59,13.92 v83.51,16.84 | v80.14,29.08 81.18,29.08 83.85,26.42 v83.85,21.46
  Bottom 0.254: v80.14,29.08 v80.14,31.67 | R30.2 v80.59,10.97 | v83.51,16.84 83.85,17.17 v83.85,21.46
DO'17  (via drill 0.6)
  Top 0.254: IC1.15 71.27,33.56 71.91,32.92 76.05,32.92 76.68,32.28 v78.43,32.28 | v78.43,29.08 79.88,27.63 IC26.1 79.86,25.6 79.86,25.82 R31.2
  Bottom 0.254: v78.43,29.08 v78.43,32.28
DO'18  (via drill 0.6)
  Top 0.254: 72.06,34.44 72.47,34.04 v74.14,34.04 | v69.93,10.97 IC25.1 69.93,13.92 v72.85,16.84 | v74.14,30.07 73.18,29.11 v73.18,21.44
  Top 0.305: 72.06,34.44 IC1.16
  Bottom 0.254: v74.14,30.07 v74.14,34.04 | v69.93,10.97 R32.2 | v72.85,16.84 73.18,17.17 v73.18,21.44
DO'19  (via drill 0.6)
  Top 0.254: 73.89,36.31 72.15,36.31 v71.91,36.55 | v70.84,30.05 69.21,28.42 IC24.1 69.24,25.6 69.24,25.82 R33.2
  Top 0.305: 73.89,36.31 IC1.17
  Bottom 0.254: v70.84,30.05 70.84,30.07 71.91,31.14 v71.91,36.55
DO'20  (via drill 0.6)
  Top 0.254: IC1.29 70.06,45.9 67.46,43.31 67.11,43.31 v67.11,43.33 | v67.59,38.2 67.39,38.4 65.58,38.4 64.49,37.31 v64.49,36.88 | v59.26,10.97 IC23.1 59.26,13.94 62.18,16.87 v62.18,16.84 | v64.13,30.81 64.13,30.45 62.48,28.8 v62.48,21.44 62.48,21.41
  Bottom 0.254: v67.59,38.2 67.59,38.23 67.11,38.71 v67.11,43.33 | v64.49,36.88 64.49,31.17 v64.13,30.81 | v59.26,10.97 R34.2 | v62.18,16.84 62.18,16.87 62.48,17.17 v62.48,21.44
DO'21  (via drill 0.6)
  Top 0.254: IC1.30 69.97,46.71 67.92,44.65 65.07,44.65 v64.46,44.04 | v62.84,30.84 62.84,30.51 58.55,26.21 IC22.1 58.57,25.6 58.57,25.82 R35.2
  Bottom 0.254: v64.46,44.04 64.46,38.33 63.5,37.36 63.5,31.5 v62.84,30.84
DO'22  (via drill 0.6)
  Top 0.254: IC1.31 69.96,47.51 67.72,45.26 63.8,45.26 v63.73,45.19 | v61.57,30.86 61.54,30.89 58.27,27.61 52.12,27.61 49.3,24.79 v49.3,21.44 | v46.05,10.97 IC21.1 46.05,13.89 v49,16.84
  Bottom 0.254: v63.73,45.19 63.47,44.93 63.47,43.54 63.7,43.31 63.7,39.83 63.88,39.65 63.88,38.66 62.89,37.67 62.89,32.21 61.54,30.86 v61.57,30.86 | R36.2 v46.05,10.97 | v49.3,21.44 49.3,17.14 v49,16.84
DO'23  (via drill 0.6)
  Top 0.254: IC1.32 69.94,48.3 67.49,45.85 64.49,45.85 63.8,46.53 v63.42,46.53 | 53.31,37.24 v53.26,37.24 51.18,37.24 45.34,31.39 IC20.1 | IC20.1 45.34,25.48 | R37.2 45.34,25.82 IC20.1
  Bottom 0.254: v63.42,46.53 61.21,44.32 61.21,39.78 60.27,38.84 54.81,38.84 53.24,37.26 v53.26,37.24
DO'24  (via drill 0.6)
  Top 0.254: IC1.61 51.59,38.71 42.24,29.36 40.54,29.36 38.63,27.46 38.63,25.73 | v35.38,10.97 IC34.1 35.38,13.89 v38.33,16.84 | 38.63,21.41 v38.63,21.44 38.63,25.73 | 38.63,25.73 38.63,25.76
  Bottom 0.254: R44.2 v35.38,10.97 | v38.63,21.44 38.63,17.14 v38.33,16.84
DO'25
  Top 0.254: IC1.60 58.29,39.5 | IC1.60 | IC1.60 51.35,39.5 41.9,30.05 38.79,30.05 34.65,25.91 34.65,25.58 | 37.03,25.81 37.05,25.81 R43.2 34.7,25.82 34.7,25.6 IC33.1 34.65,25.58 | 34.65,25.58 34.65,25.55
  Top 0.305: IC1.60
DO'26  (via drill 0.6)
  Top 0.254: IC1.59 58.24,40.28 51.05,40.28 41.53,30.76 31.44,30.76 27.97,27.28 v27.97,21.44 27.97,21.41 | v24.71,11 IC32.1 24.71,13.92 27.66,16.87 v27.66,16.84
  Top 0.305: IC1.59
  Bottom 0.254: R42.2 v24.71,11 | v27.66,16.84 27.63,16.84 27.97,17.17 v27.97,21.44
DO'27
  Top 0.254: IC1.58 50.88,41.1 41.2,31.42 31.17,31.42 26.39,26.64 R41.2 | R41.2 | 23.98,25.6 23.98,25.58 | IC31.1 23.98,25.6 | R41.2 23.98,25.82 23.98,25.6
  Top 0.305: 58.24,41.15 IC1.58
DO'28  (via drill 0.6)
  Top 0.254: IC1.57 58.22,41.88 50.75,41.88 40.92,32.05 30.89,32.05 28.85,30.02 19.63,30.02 17.3,27.69 v17.3,21.44 | v14.05,11 IC30.1 14.02,13 14.02,13.87 v16.99,16.84
  Top 0.305: 58.24,41.96 IC1.57
  Bottom 0.254: v14.05,11 R40.2 | v17.3,21.44 17.3,17.14 v16.99,16.84
DO'29
  Top 0.254: 58.27,42.7 50.62,42.7 40.64,32.71 30.63,32.71 28.63,30.71 19.35,30.71 15.72,27.08 R39.2 | R39.2 | R39.2 13.33,25.82 IC29.1
  Top 0.305: 58.32,42.7 58.27,42.7 IC1.56
DO'30  (via drill 0.6)
  Top 0.254: 58.23,43.48 58.12,43.38 | IC1.55 58.15,43.41 50.37,43.41 40.33,33.38 30.3,33.38 28.32,31.39 15.34,31.39 13.89,29.95 10.41,29.95 1.5,21.03 1.5,14.86 3.38,12.98 | v3.38,10.97 3.38,12.98 | 3.38,12.98 IC28.1
  Top 0.305: IC1.55 58.23,43.48
  Bottom 0.254: v3.38,10.97 R38.2
GND  (via drill 0.6)
  Top 0.254: IC11.4 23.77,65.56 v23.77,65.66 | IC10.4 34.44,65.76 34.44,65.68 | v34.44,65.66 34.44,65.68 | IC9.4 34.44,65.56 34.44,65.68 | IC8.4 42.44,65.66 43.08,65.66 R17.1 | 53.11,65.79 IC6.4 53.11,65.66 53.75,65.66 R15.1 | 63.78,65.79 IC4.4 63.78,65.66 64.41,65.66 R29.1 | IC18.4 | IC18.4 74.45,65.66 75.08,65.66 R27.1 | 85.12,65.79 IC16.4 85.12,65.66 85.75,65.66 R25.1 | IC15.4 | v87.78,65.66 90.45,65.66 IC15.4 | IC7.4 45.11,65.56 v45.11,65.66 | IC5.4 55.78,65.56 v55.78,65.66 | IC19.4 66.45,65.56 v66.45,65.66 | IC17.4 77.11,65.56 v77.11,65.66 | IC28.4 3.02,19.2 v3.02,19.3 | IC29.4 8.36,19.41 v8.36,19.3 | IC31.4 24.33,19.41 v24.33,19.3 | IC32.4 | 27.03,19.23 27.03,19.3 | 29.69,19.28 v29.69,19.3 29.69,19.41 IC33.4 | v35.03,19.3 35.03,19.2 | IC20.4 40.36,19.41 v40.36,19.28 | v50.98,19.3 50.98,19.2 | IC22.4 53.62,19.41 53.62,19.33 | IC23.4 58.9,19.2 v58.9,19.3 | IC24.4 64.24,19.41 v64.24,19.3 | IC25.4 69.57,19.2 v69.57,19.3 | IC26.4 74.9,19.41 v74.9,19.3 | IC27.4 80.24,19.2 v80.24,19.3 | IC12.4 90.88,19.41 v90.88,19.3 | 32.41,65.66 R19.1 | R22.1 92.91,19.3 93.47,19.3 IC13.4 | 82.24,19.3 R31.1 | 71.58,19.3 R33.1 | 60.91,19.3 R35.1 | R37.1 47.73,19.3 48.26,19.3 IC21.4 | R43.1 37.06,19.3 37.59,19.3 IC34.4 | R41.1 26.39,19.3 26.95,19.3 27.03,19.23 | R39.1 15.72,19.3 16.23,19.3 16.36,19.18 IC30.4 | 27.03,19.23 IC32.4 | IC34.4 37.72,19.18 | IC34.4 | IC21.4 | IC13.4
  Top 0.305: 58.24,45.08 IC1.53 58.26,45.08 | 73.89,40.31 IC1.22
  Top 0.406: IC1.53 56.58,45.1 v55.91,44.42 | 58.26,45.08 59.77,45.08 v60.17,44.68 | IC1.63 56.91,37.1 arc-90 56.9,37.11 | v72.03,40.49 72.03,40.51 72.24,40.31 73.89,40.31 | 73.89,40.28 73.86,40.28 | IC1.22 73.89,40.28 | 73.89,40.28 76.69,40.28 C4.2 77.13,40.22 78.74,38.61 v78.74,38.13
  Top 0.61: C14.2 26.6,50.41 26.36,50.65 IC3.2 22.02,50.65 v22.05,50.62
  Top 0.813: 56.9,37.11 v56.29,37.11 v55.04,37.11 | v60.17,44.68 v60.17,43.51
  Top 1.016: v1.73,70.03 4.47,70.03 4.47,70.66 | 3.38,71.53 4.47,71.53 D4.A | 3.38,71.53 v1.73,71.53 | 3.38,71.53 v3.38,72.95 | 5,71.53 v5,72.97 | 5,71.53 5.03,71.53 | D4.A 4.44,70.69 | 5,71.53 5,71.25 D4.A | v1.83,40.46 1.8,40.46 1.84,40.5 R4.1 | v5.16,47.24 5.13,47.24 5.14,47.23 C12.2 | v26.31,44.37 C8.2 | C8.2 | v27.76,45.82 27.76,44.37 C8.2 | C9.2 33.38,44.35 | 33.38,44.35 v34.75,44.35 | 33.38,44.35 33.35,44.37 v33.35,45.82 | 27.58,50.42 C14.2 v27.58,49 | v35.66,50.85 33.93,50.85 D2.A 33.96,50.29 33.96,49.76 v35.66,49.76 | C15.1 v18.41,59.84 18.39,59.82 18.39,58.57 v18.41,58.57 18.19,58.34 v18.19,57.18 18.19,55.79 R12.2 | R2.1 v36.07,35.81 v37.44,35.81 | 53.21,44.42 v53.24,44.42 54.57,44.42 C5.2 v55.91,44.42 | v72.03,40.49 v70.79,40.49 v60.3,40.49 | 95.05,65.66 v95.05,63.86 | v96.77,63.86 96.77,65.73 95.78,65.73
  Top 1.27: IC11.3 28.75,65.63 29.11,65.63 v29.11,65.66 29.11,65.68 | IC9.3 v39.42,61.92 v39.42,63.42 39.42,65.66 v39.78,65.66 39.78,65.68 40.13,65.68 v40.13,67.89 v40.13,69.42 IC8.3 | IC7.3 v50.09,61.92 v50.09,63.42 50.09,65.66 50.42,65.66 | IC5.3 v60.76,61.92 v60.76,63.42 60.76,65.68 61.11,65.68 v61.11,65.66 61.47,65.66 v61.47,67.89 v61.47,69.42 IC4.3 | IC19.3 v71.42,61.92 v71.42,63.42 71.42,65.66 v71.78,65.66 72.14,65.66 v72.14,67.89 v72.14,69.42 IC18.3 | IC17.3 v82.09,61.92 v82.09,63.42 82.09,65.66 v82.45,65.66 82.45,65.63 82.8,65.63 v82.8,67.89 v82.8,69.42 IC16.3 | IC15.3 v92.76,61.92 v92.76,63.42 92.76,65.66 v93.12,65.66 93.47,65.66 v93.47,67.89 v93.47,69.42 IC14.3 | 29.11,65.68 29.11,65.71 | IC10.3 v29.46,69.42 v29.46,67.89 29.46,65.68 29.11,65.68 | v50.44,65.66 50.44,65.68 50.8,65.68 v50.8,67.89 v50.8,69.42 IC6.3 | IC28.3 v8,15.49 v8,17.02 8,19.3 v8.36,19.3 8.36,19.28 8.71,19.28 v8.71,21.59 v8.71,23.09 IC29.3 | IC30.3 v18.67,15.49 v18.67,17.02 18.67,19.3 v19.02,19.3 19.02,19.33 19.38,19.33 v19.38,21.59 v19.38,23.09 IC31.3 | IC32.3 v29.34,15.49 v29.34,17.02 29.34,19.3 v29.69,19.3 30.05,19.3 v30.05,21.59 v30.05,23.09 IC33.3 | IC34.3 v40,15.49 v40,17.02 40,19.28 v40.36,19.28 40.36,19.25 40.72,19.25 v40.72,21.59 v40.72,23.09 IC20.3 | IC21.3 v50.67,15.49 v50.67,17.02 50.67,19.3 v50.98,19.3 | IC23.3 v63.88,15.49 v63.88,17.02 63.88,19.28 64.24,19.28 v64.24,19.3 64.59,19.3 v64.59,21.59 v64.59,23.09 IC24.3 | IC25.3 v74.55,15.49 v74.55,17.02 74.55,19.3 v74.9,19.3 74.9,19.28 75.26,19.28 v75.26,21.59 v75.26,23.09 IC26.3 | IC27.3 v85.22,15.49 v85.22,17.02 85.22,19.33 85.57,19.33
  Top 1.27: v53.62,19.3 53.62,19.33 53.92,19.33 v53.92,21.59 v53.92,23.09 IC22.3 | v85.57,19.3 85.57,19.33 | IC12.3 v85.93,23.09 v85.93,21.59 85.93,19.33 85.57,19.33
  Top 1.778: X1.1 11.86,80.21 11.84,80.21 11.84,78.03 4.47,70.66 D4.A
  Top 1.93: v3.02,19.3 v8.36,19.3 v13.69,19.3 15.72,19.3 v19.02,19.3 v24.33,19.3 26.39,19.3 v29.69,19.3 v35.03,19.3 37.06,19.3 47.73,19.3 v50.98,19.3 v53.62,19.3 v58.9,19.3 60.91,19.3 v64.24,19.3 v69.57,19.3 71.58,19.3 v74.9,19.3 v80.24,19.3 82.24,19.3 v85.57,19.3 v90.88,19.3 92.91,19.3 v96.24,19.3 | IC14.4 | IC14.4 95.78,65.73 95.78,65.66 95.05,65.66 v93.12,65.66 v87.78,65.66 85.75,65.66 v82.45,65.66 v77.11,65.66 75.08,65.66 v71.78,65.66 v66.45,65.66 64.41,65.66 v61.11,65.66 v55.78,65.66 53.75,65.66 v50.44,65.66 50.42,65.66 v45.11,65.66 43.08,65.66 v39.78,65.66 v34.44,65.66 32.41,65.66 v29.11,65.66 v23.77,65.66 v23.77,73.53
  other vias: 45.69,19.3 98.55,61.01 89.76,48.74 86.03,54.51 92.84,54.71 98.12,45.64 98.17,52.17 93.42,41.99 98.58,37.57 98.32,30.53 91.69,31.42 95.94,23.75 97.92,13.74 23.77,68.78 23.77,67.26 97.26,5.66 23.77,70.38 23.77,71.96 28.75,63.42 28.75,61.93 89.26,54.64 86.99,51.49 93.57,50.52 92.2,45.87 98.15,41.55 93.27,37.08 95.48,33.93 97.28,16.46 96.82,9.83
  pour Bottom (isolate 0.406): 84.51,27.86 0.13,27.86 0.13,81.33 3.66,81.33 3.66,75.56 7.67,71.55 7.67,64.9 9.6,62.97 15.14,62.97 17.17,65 17.17,73.03 15.14,75.06 13.94,75.06 9.93,79.07 9.93,82.4 8.38,83.95 8.38,84.86 96.34,84.86 96.34,81.36 99.87,81.36 99.87,3.68 96.34,3.68 96.34,0.13 3.63,0.15 3.63,3.68 0.13,3.68 0.13,27.23 84.84,27.23 92.05,34.44 92.05,43.97 78.71,57.3 22.96,57.3 21.23,59.03 21.23,66.24 22.22,67.23 22.22,73.41 21.64,73.41 21.64,67.49 20.6,66.45 20.6,58.7 22.71,56.59 78.41,56.59 91.39,43.61 91.39,34.75
  pour Top: 92.35,56.39 85.57,56.39 84.12,54.94 84.12,51.89 92.05,43.97 92.05,34.42 89.94,32.31 89.94,30.56 95.4,25.1 95.4,7.04 94.79,6.43 94.79,3.76 99.87,3.76 99.87,62.61 98.58,62.61
MISO  (via drill 0.6)
  Top 0.254: IC1.3 61.67,34.44 | IC1.3 | v60.86,36.5 60.86,36.45 61.67,35.64 IC1.3 | 54.72,34.56 54.69,34.59 | U$1.PAD2 54.72,34.56 | v58.04,34.21 55.07,34.21 54.72,34.56
  Top 0.305: 61.7,34.44 61.7,34.48 IC1.3
  Bottom 0.254: v60.86,36.5 60.88,36.5 58.6,34.21 v58.04,34.21
MOSI
  Top 0.254: IC1.2 60.88,33.32 60.53,32.97 53.16,32.97 U$1.PAD3
  Top 0.305: IC1.2
N$1
  Top 0.406: 6.78,53.59 6.76,53.61 L1.2
  Top 1.778: 6.78,53.59 9.19,53.59 10.36,52.43 10.64,52.43 10.64,58.47 10.71,58.53 | L1.2 5.63,53.61 4.32,52.3 C11.1
  Top 2.54: F1.1A 12.45,56.79 10.71,58.53 5.94,63.3 D4.C
N$2
  Top 0.254: D5.C 1.83,37.19 D3.C
N$3
  Top 0.254: 3.54,39.79 3.56,39.8 R3.2 | 3.54,39.79 R4.2 | 3.54,39.79 3.53,39.78 3.53,38 4.34,37.19 4.37,37.21 D5.A
N$4  (via drill 0.6)
  Top 0.254: IC1.24 75.28,41.9 76.58,43.21 v76.58,47.35
  Bottom 0.254: 83.54,49.48 C1.2 81.94,49.48 Q1.2 v76.58,47.35
N$6  (via drill 0.6)
  Top 0.254: IC1.23 75.47,41.11 76.17,41.81 v76.68,41.81
  Bottom 0.254: v76.68,41.81 77.14,42.27 Q1.1 79.86,42.32 83.51,42.32 C2.2
N$7
  Top 0.254: IC3.8 20.37,49.38 21.03,50.04 21.03,51.41 21.72,52.1 21.72,54.97 22.22,55.47 R8.2
N$8  (via drill 0.6)
  Top 0.254: 48.62,48.74 48.56,48.74 47.07,50.24 38.89,50.24 35.99,53.14 31.17,53.14 30.28,54.03 27.71,54.03 26.29,55.45 23.95,55.45 23.95,55.46 R8.1 | v66.42,37.39 66.4,37.36 66.48,37.28 IC1.9
  Top 0.406: 48.62,48.74 v52.17,48.74
  Bottom 0.254: v52.17,48.74 53.16,47.75 65.46,47.75 66.07,47.14 66.07,42.95 66.45,42.57 66.45,37.41 v66.42,37.39
N$9
  Top 0.254: 32.97,35.81 R2.2 32.89,35.81 | R1.1 32.89,35.81 | IC2.1 33.65,38.4 32.89,37.64 32.89,35.81
N$13
  Top 0.254: R9.1 40.4,44.74 41.25,45.59 42.16,45.59 42.16,45.55 U$4.B
N$14
  Top 0.254: R13.2 47.32,46.1 45.2,46.1 U$4.C
N$16
  Top 0.406: 14.96,46.17 D1.C
  Top 1.016: 27.86,41.33 28.45,41.33 IC2.3 28.57,42.34 29.53,43.29 C8.1
  Top 2.184: 14.96,44.73 14.96,46.17
  Top 2.54: 12.78,37.69 12.75,37.67 | C7.+ 12.78,37.69 | 14.96,41.91 14.96,39.88 12.78,37.69 | 14.96,41.91 14.96,44.73 | 27.89,41.33 27.86,41.33 24.36,41.33 23.77,41.91 14.96,41.91
N$24
  Top 0.254: JP3.1 44.91,48.03 47.1,48.03 R13.1
N$25
  Top 0.406: R11.2 19.84,70.96 19.84,69.24 R10.1 19.85,68.67 19,67.82 19,63.91 18.41,63.32 C15.2
N$113
  Top 0.254: JP1.1 85.75,37.64 85.32,37.21 R5.1
N$114
  Top 0.254: R6.1 87.81,36.02 JP2.1
N$115
  Top 0.254: IC1.19 75.33,37.91 79.68,33.55 R5.2
N$116
  Top 0.254: IC1.18 75.06,37.11 79.27,32.89 80.64,32.89 81.03,32.51 87.27,32.51 87.53,32.77 R6.2
POWER_FAIL  (via drill 0.6)
  Top 0.254: C12.1 6.81,43.21 6.58,42.98 D6.A 5.26,41.71 5.26,39.79 | 5.26,39.79 5.26,39.78 | 5.26,39.79 R3.1 5.26,39.9 5.28,39.9 5.28,39.82 10.57,34.53 10.57,32.08 11.99,30.66 13.69,30.66 15.04,32 27.99,32 29.95,33.96 29.95,34.01 40.06,34.01 43.36,37.31 43.36,39.5 44.5,40.64 v44.5,40.67 | IC1.25 69.4,42.7 68.43,41.73 60.53,41.73 60.25,42.01 v60.25,41.99
  Top 0.406: R3.1
  Bottom 0.254: v60.25,41.99 45.82,41.99 v44.5,40.67
RXD  (via drill 0.6)
  Top 0.254: IC3.4 26.01,53.19 26.19,53.37 29.95,53.37 30.89,52.43 35.81,52.43 39.6,48.64 39.6,48.62 | R9.2 39.61,46.46 39.6,46.46 39.6,48.62 | v41.48,53.7 41.81,53.37 52.15,53.37 55.88,49.63 58.8,49.63 62.31,46.13 62.31,44.81 64.74,42.37 68.1,42.37 69.27,43.54 73.86,43.54 73.88,43.54 | 73.88,43.54 IC1.26 | IC1.27 73.9,44.3 73.86,44.3 73.86,43.55 73.88,43.54 | v39.93,48.82 39.8,48.82 39.6,48.62
  Top 0.305: 73.86,43.54 73.86,43.51 IC1.26
  Bottom 0.254: v41.48,53.7 41.5,53.67 41.5,50.42 39.9,48.82 v39.93,48.82
SCK
  Top 0.254: 68.02,34.48 68.02,31.65 67.49,31.11 66.6,31.11 65.63,32.08 61.39,32.08 60.91,31.6 56.84,31.6 54.71,29.46 U$1.PAD6
  Top 0.305: 68.02,34.48 IC1.11
TXD  (via drill 0.6)
  Top 0.254: v26.06,49.22 26.06,49.2 25.88,49.38 24,49.38 | v31.9,48.87 32.31,48.46 36.93,48.46 37.67,49.2 v37.62,49.2 | v39.22,51.21 39.55,50.88 48.31,50.88 49.1,50.09 50.62,50.09 v50.62,50.04 | v70.41,44.98 70.41,44.96 70.55,45.1 IC1.28
  Top 0.406: IC3.1 24,49.38
  Bottom 0.254: v26.06,49.22 26.9,50.06 30.73,50.06 31.93,48.87 v31.9,48.87 | v37.62,49.2 37.62,49.61 v39.22,51.21 | v70.41,44.98 67.11,48.29 55.04,48.29 53.29,50.04 v50.62,50.04
V+
  Bottom 1.778: X1.2 6.81,77.62 12.5,71.93 12.5,71.58 | 12.5,71.58 F1.2A | 12.5,66.24 12.5,71.58